# EAGLE schematic l3lfinal (EAGLE 6.5.0)
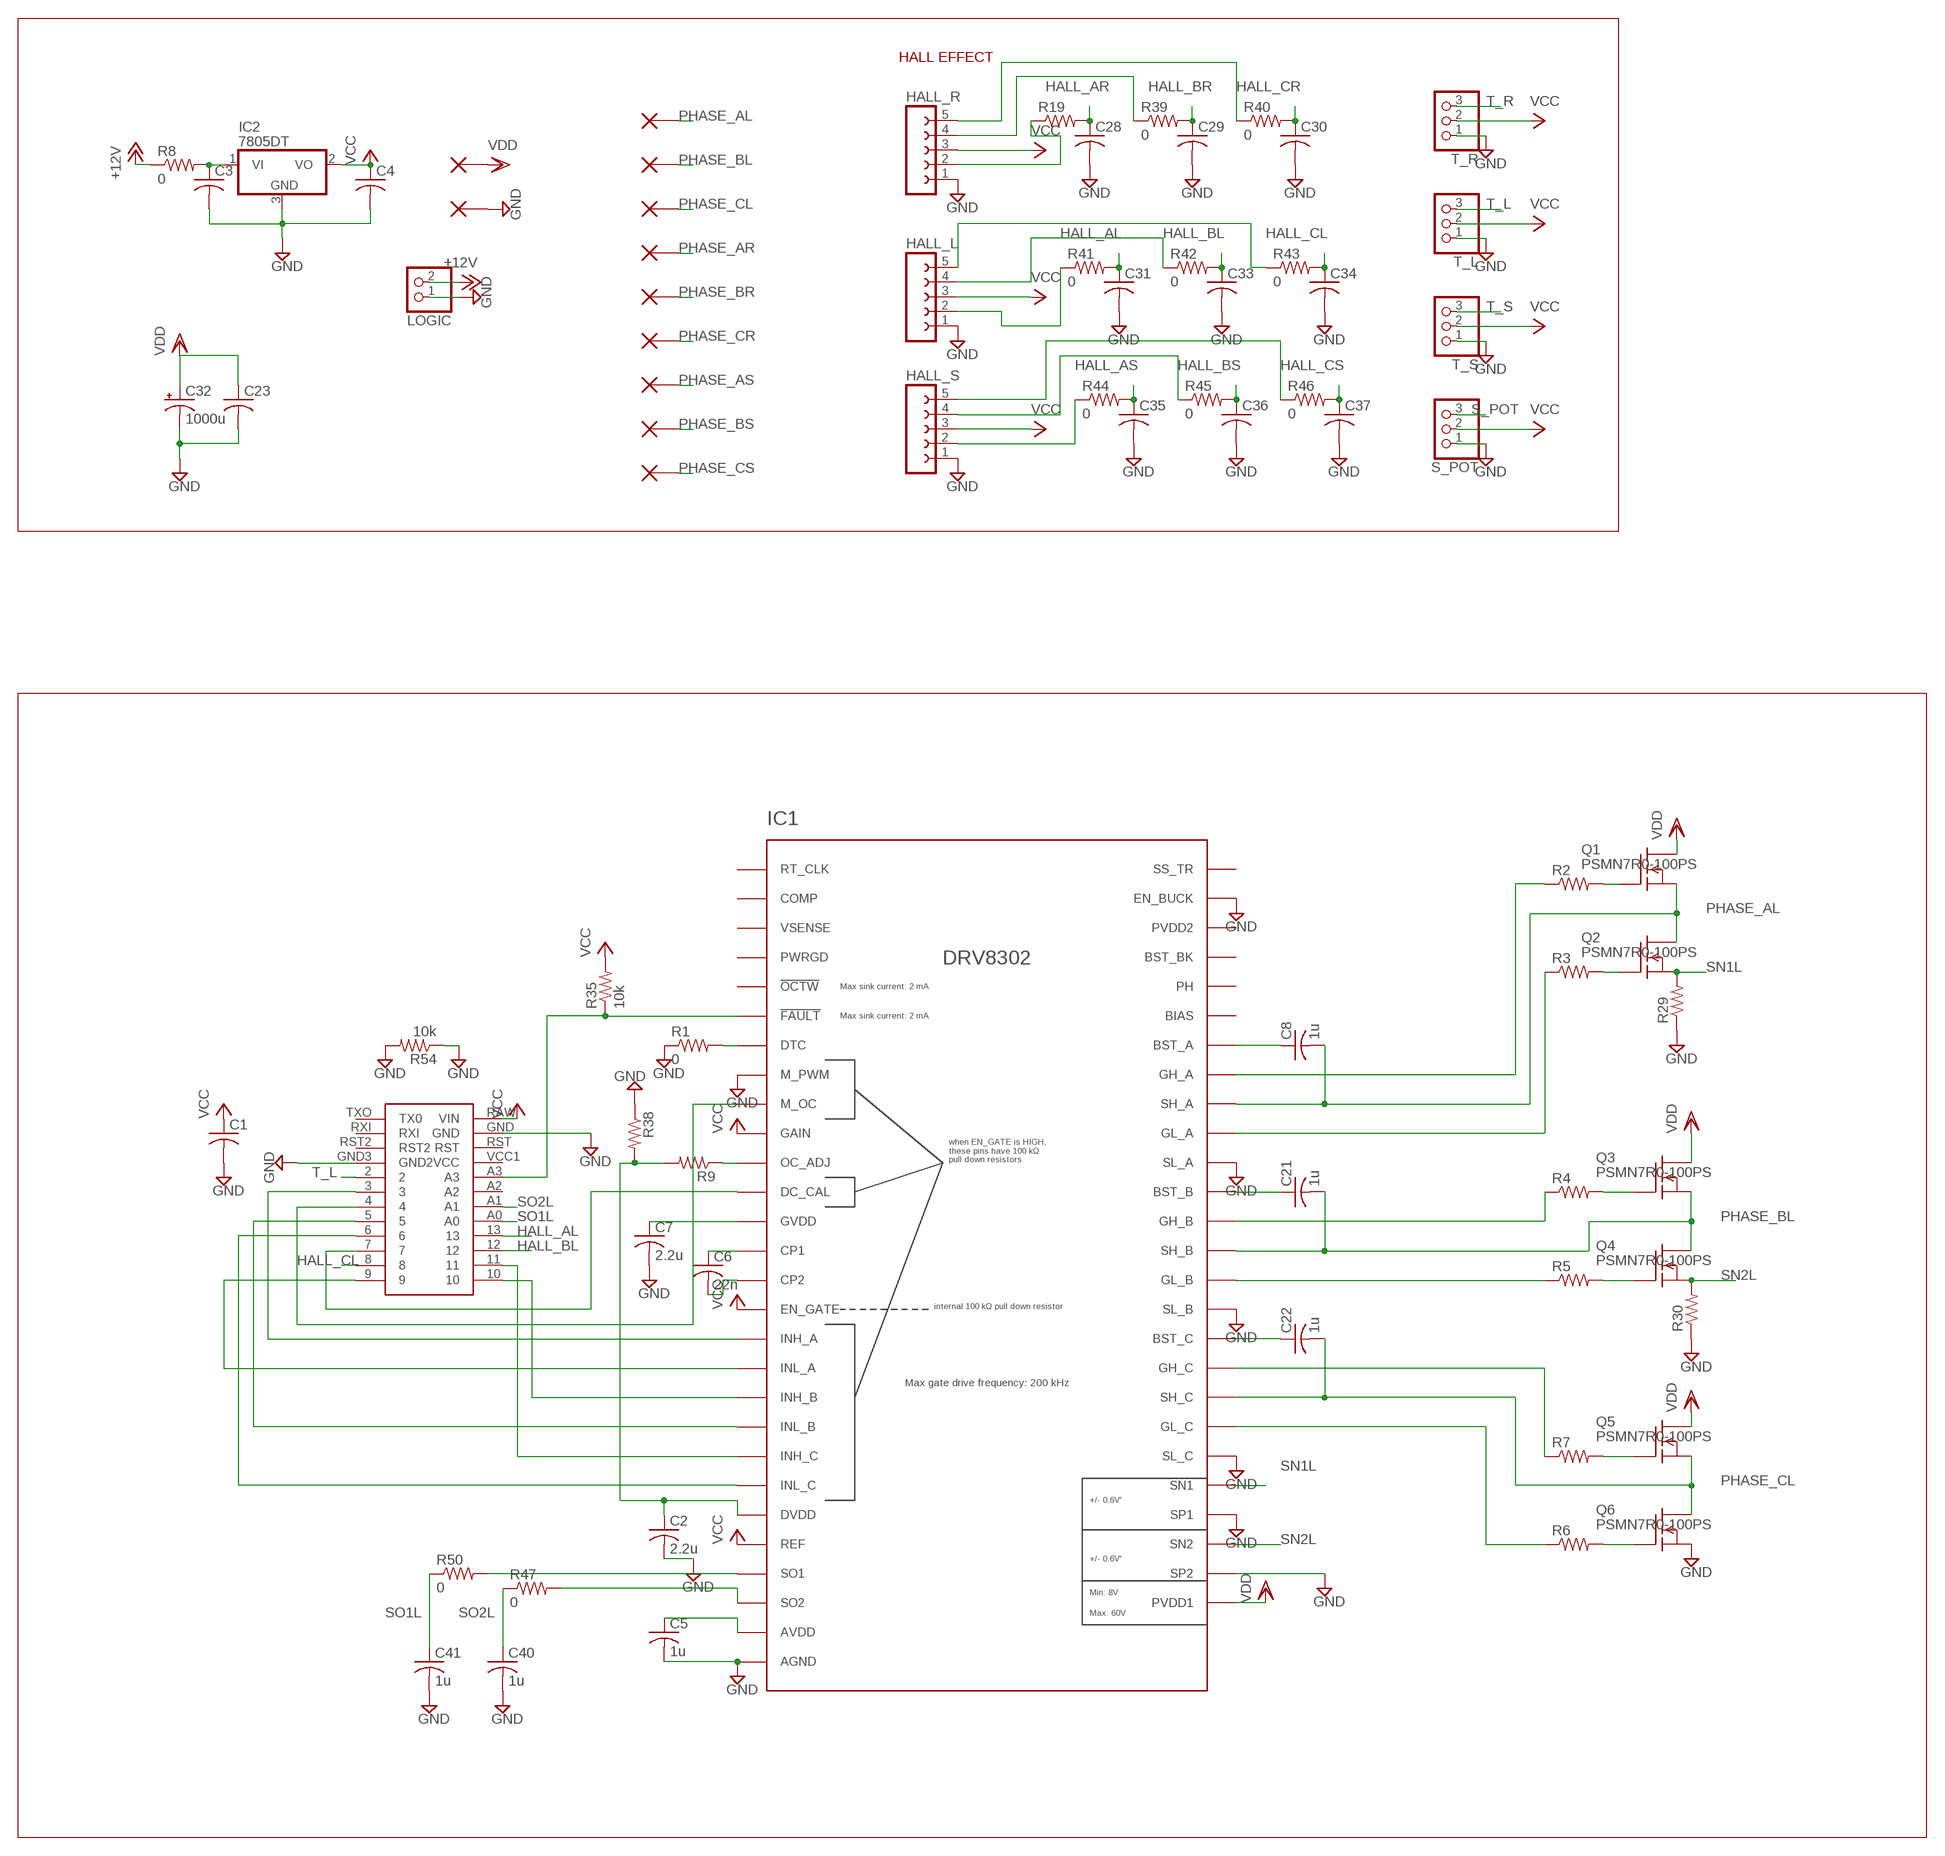
[diagram p0: schematic, sheet 1, part 1 of 3]
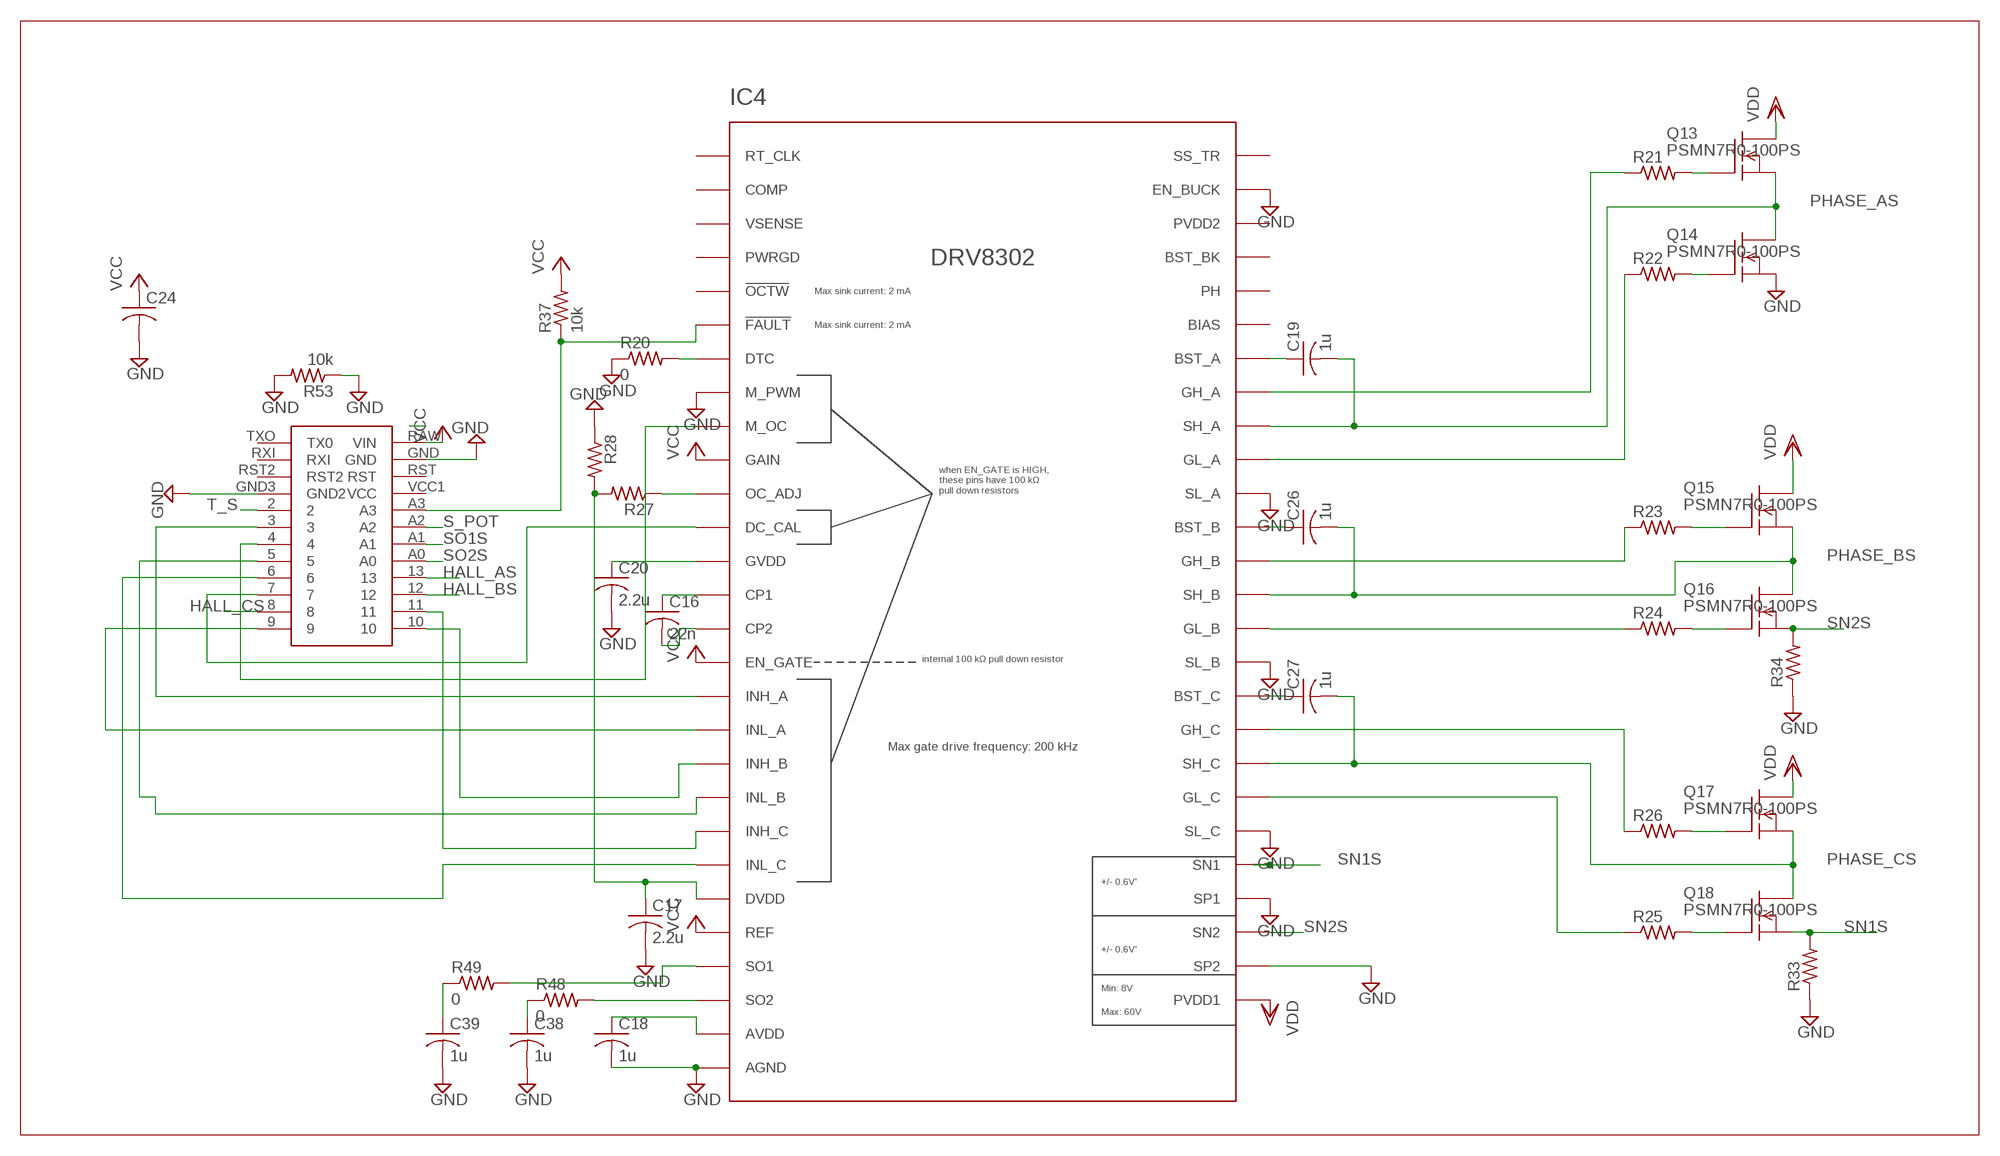
[diagram p1: schematic, sheet 1, part 2 of 3]
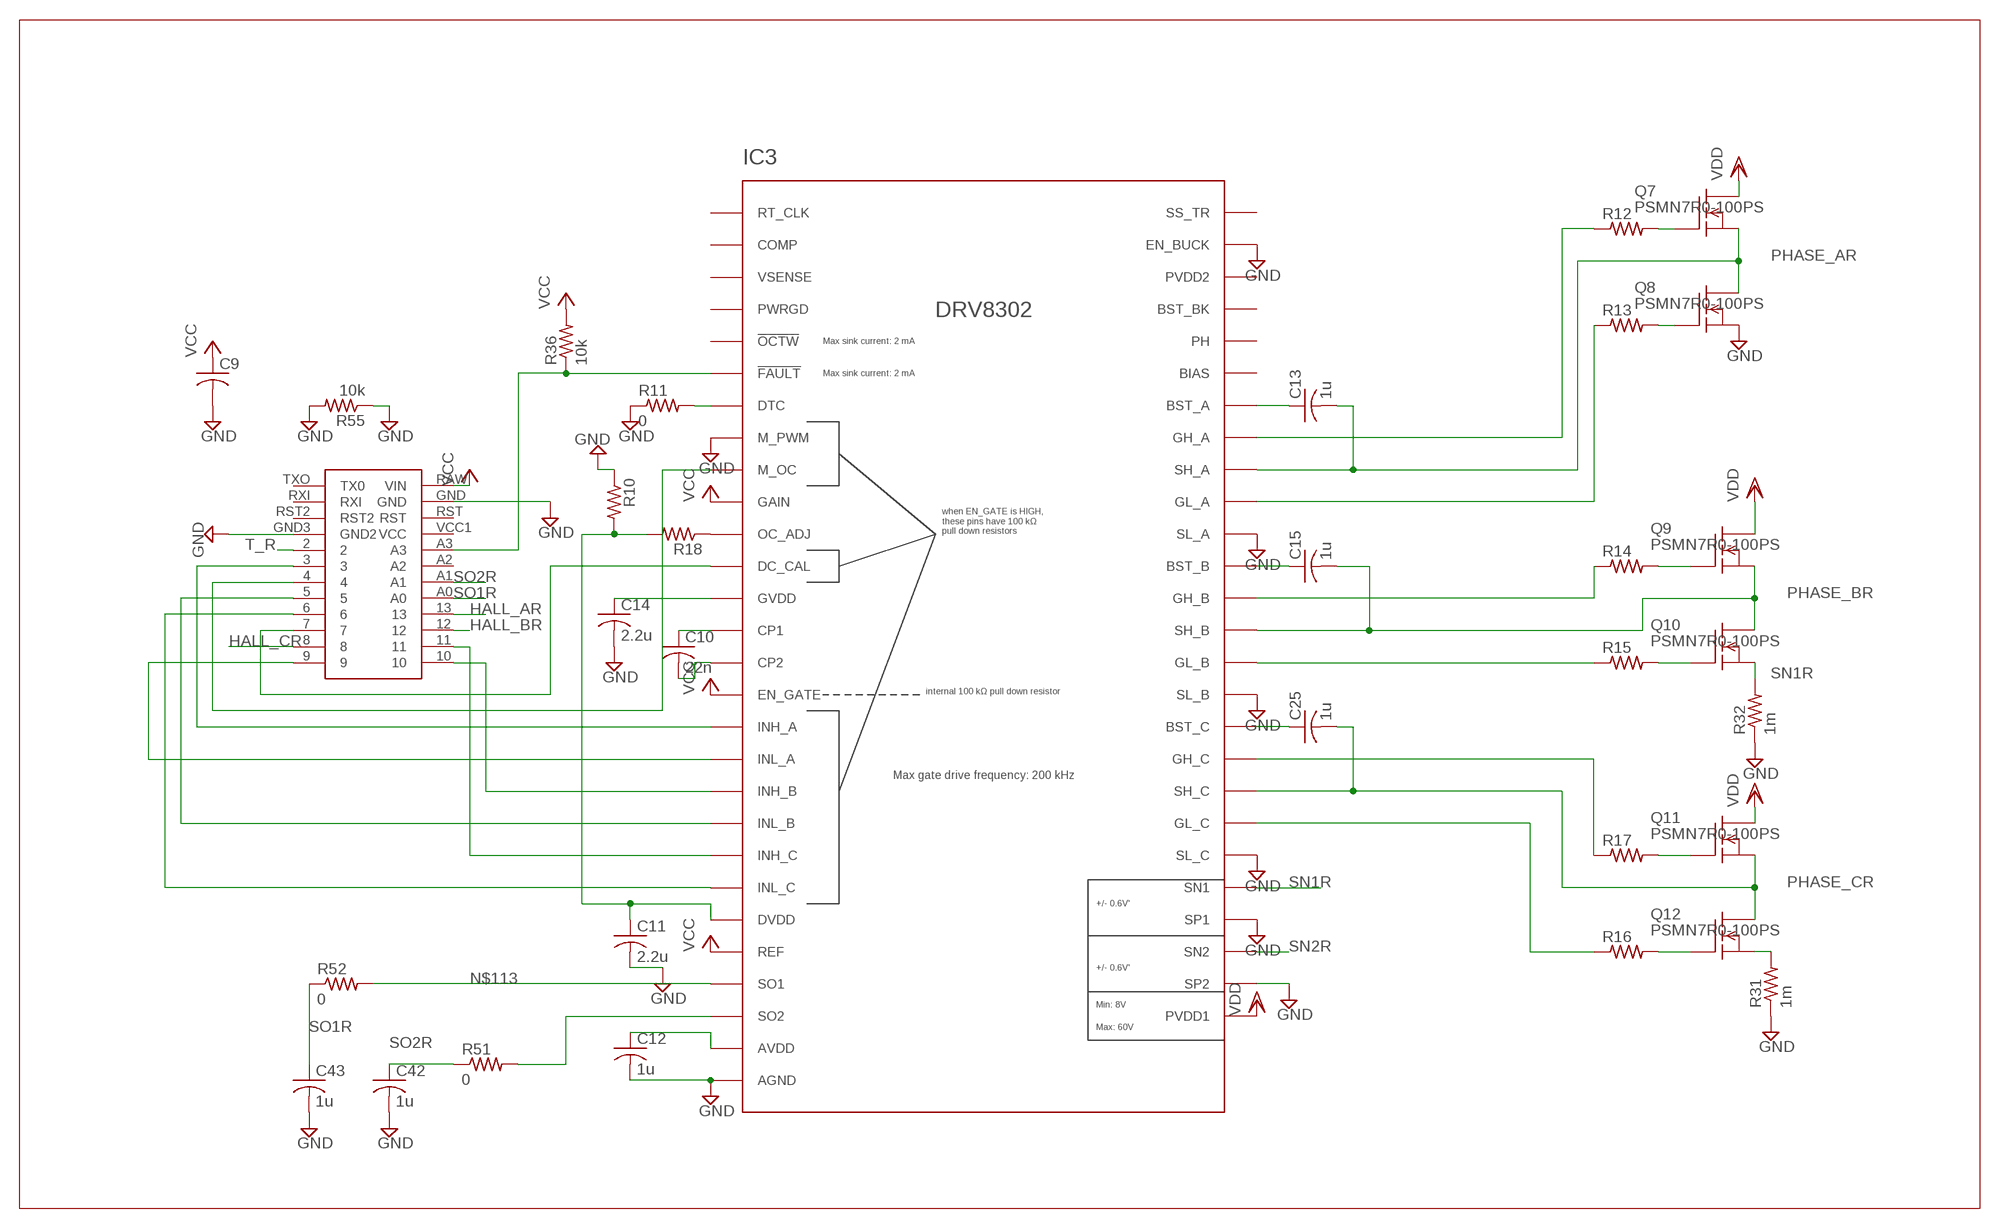
[diagram p2: schematic, sheet 1, part 3 of 3]

## Parts
C1  C-USC0805K  [C0805K]
C2  2.2u  C-USC0805K  [C0805K]
C3  C-USC1206K  [C1206K]
C4  C-USC1206K  [C1206K]
C5  1u  C-USC0805K  [C0805K]
C6  22n  C-USC0805K  [C0805K]
C7  2.2u  C-USC0805K  [C0805K]
C8  1u  C-USC0805K  [C0805K]
C9  C-USC0805K  [C0805K]
C10  22n  C-USC0805K  [C0805K]
C11  2.2u  C-USC0805K  [C0805K]
C12  1u  C-USC0805K  [C0805K]
C13  1u  C-USC0805K  [C0805K]
C14  2.2u  C-USC0805K  [C0805K]
C15  1u  C-USC0805K  [C0805K]
C16  22n  C-USC0805K  [C0805K]
C17  2.2u  C-USC0805K  [C0805K]
C18  1u  C-USC0805K  [C0805K]
C19  1u  C-USC0805K  [C0805K]
C20  2.2u  C-USC0805K  [C0805K]
C21  1u  C-USC0805K  [C0805K]
C22  1u  C-USC0805K  [C0805K]
C23  C-USC1206K  [C1206K]
C24  C-USC0805K  [C0805K]
C25  1u  C-USC0805K  [C0805K]
C26  1u  C-USC0805K  [C0805K]
C27  1u  C-USC0805K  [C0805K]
C28  C-USC0805K  [C0805K]
C29  C-USC0805K  [C0805K]
C30  C-USC0805K  [C0805K]
C31  C-USC0805K  [C0805K]
C32  1000u  CPOL-USE5-13  [E5-13]
C33  C-USC0805K  [C0805K]
C34  C-USC0805K  [C0805K]
C35  C-USC0805K  [C0805K]
C36  C-USC0805K  [C0805K]
C37  C-USC0805K  [C0805K]
C38  1u  C-USC0805K  [C0805K]
C39  1u  C-USC0805K  [C0805K]
C40  1u  C-USC0805K  [C0805K]
C41  1u  C-USC0805K  [C0805K]
C42  1u  C-USC0805K  [C0805K]
C43  1u  C-USC0805K  [C0805K]
GND  12AWG_PAD  [12AWG_PAD]
HALL_L  FE05-1  [FE05-1]
HALL_R  FE05-1  [FE05-1]
HALL_S  FE05-1  [FE05-1]
IC1  DRV8302  [TSSOP-56_3]
IC2  7805DT  [TO252]
IC3  DRV8302  [TSSOP-56_3]
IC4  DRV8302  [TSSOP-56_3]
LOGIC  PINHD-1X2  [1X02]
PHASE_AL  12AWG_PAD  [12AWG_PAD]
PHASE_AR  12AWG_PAD  [12AWG_PAD]
PHASE_AS  12AWG_PAD  [12AWG_PAD]
PHASE_BL  12AWG_PAD  [12AWG_PAD]
PHASE_BR  12AWG_PAD  [12AWG_PAD]
PHASE_BS  12AWG_PAD  [12AWG_PAD]
PHASE_CL  12AWG_PAD  [12AWG_PAD]
PHASE_CR  12AWG_PAD  [12AWG_PAD]
PHASE_CS  12AWG_PAD  [12AWG_PAD]
Q1  PSMN7R0-100PS  [TO220]
Q2  PSMN7R0-100PS  [TO220]
Q3  PSMN7R0-100PS  [TO220]
Q4  PSMN7R0-100PS  [TO220]
Q5  PSMN7R0-100PS  [TO220]
Q6  PSMN7R0-100PS  [TO220]
Q7  PSMN7R0-100PS  [TO220]
Q8  PSMN7R0-100PS  [TO220]
Q9  PSMN7R0-100PS  [TO220]
Q10  PSMN7R0-100PS  [TO220]
Q11  PSMN7R0-100PS  [TO220]
Q12  PSMN7R0-100PS  [TO220]
Q13  PSMN7R0-100PS  [TO220]
Q14  PSMN7R0-100PS  [TO220]
Q15  PSMN7R0-100PS  [TO220]
Q16  PSMN7R0-100PS  [TO220]
Q17  PSMN7R0-100PS  [TO220]
Q18  PSMN7R0-100PS  [TO220]
R1  0  R-US_R0805  [R0805]
R2  R-US_R0805  [R0805]
R3  R-US_R0805  [R0805]
R4  R-US_R0805  [R0805]
R5  R-US_R0805  [R0805]
R6  R-US_R0805  [R0805]
R7  R-US_R0805  [R0805]
R8  0  R-US_R0805  [R0805]
R9  R-US_R0805  [R0805]
R10  R-US_R0805  [R0805]
R11  0  R-US_R0805  [R0805]
R12  R-US_R0805  [R0805]
R13  R-US_R0805  [R0805]
R14  R-US_R0805  [R0805]
R15  R-US_R0805  [R0805]
R16  R-US_R0805  [R0805]
R17  R-US_R0805  [R0805]
R18  R-US_R0805  [R0805]
R19  R-US_R0805  [R0805]
R20  0  R-US_R0805  [R0805]
R21  R-US_R0805  [R0805]
R22  R-US_R0805  [R0805]
R23  R-US_R0805  [R0805]
R24  R-US_R0805  [R0805]
R25  R-US_R0805  [R0805]
R26  R-US_R0805  [R0805]
R27  R-US_R0805  [R0805]
R28  R-US_R0805  [R0805]
R29  R-US_R2512  [R2512]
R30  R-US_R2512  [R2512]
R31  1m  R-US_R2512  [R2512]
R32  1m  R-US_R2512  [R2512]
R33  R-US_R2512  [R2512]
R34  R-US_R2512  [R2512]
R35  10k  R-US_R0805  [R0805]
R36  10k  R-US_R0805  [R0805]
R37  10k  R-US_R0805  [R0805]
R38  R-US_R0805  [R0805]
R39  0  R-US_R0805  [R0805]
R40  0  R-US_R0805  [R0805]
R41  0  R-US_R0805  [R0805]
R42  0  R-US_R0805  [R0805]
R43  0  R-US_R0805  [R0805]
R44  0  R-US_R0805  [R0805]
R45  0  R-US_R0805  [R0805]
R46  0  R-US_R0805  [R0805]
R47  0  R-US_R0805  [R0805]
R48  0  R-US_R0805  [R0805]
R49  0  R-US_R0805  [R0805]
R50  0  R-US_R0805  [R0805]
R51  0  R-US_R0805  [R0805]
R52  0  R-US_R0805  [R0805]
R53  10k  R-US_R0805  [R0805]
R54  10k  R-US_R0805  [R0805]
R55  10k  R-US_R0805  [R0805]
S_POT  PINHD-1X3  [1X03]
T_L  PINHD-1X3  [1X03]
T_R  PINHD-1X3  [1X03]
T_S  PINHD-1X3  [1X03]
U$1  ARDUINOPROMINI  [ARDUINOPROMINI]
U$2  ARDUINOPROMINI  [ARDUINOPROMINI]
U$3  ARDUINOPROMINI  [ARDUINOPROMINI]
VDD  12AWG_PAD  [12AWG_PAD]

## Nets
+12V: LOGIC.2 R8.1
GND: C1.2 C2.2 C3.2 C4.2 C5.2 C7.2 C9.2 C11.2 C12.2 C14.2 C17.2 C18.2 C20.2 C23.2 C24.2 C28.2 C29.2 C30.2 C31.2 C32.- C33.2 C34.2 C35.2 C36.2 C37.2 C38.2 C39.2 C40.2 C41.2 C42.2 C43.2 GND.P$1 HALL_L.1 HALL_R.1 HALL_S.1 IC1.8(M_PWM) IC1.28(AGND) IC1.30(SP2) IC1.32(SP1) IC1.34(SL_C) IC1.39(SL_B) IC1.44(SL_A) IC1.55(EN_BUCK) IC1.57(AGND) IC1.58(AGND) IC1.59(AGND) IC2.3(GND) IC3.8(M_PWM) IC3.28(AGND) IC3.30(SP2) IC3.32(SP1) IC3.34(SL_C) IC3.39(SL_B) IC3.44(SL_A) IC3.55(EN_BUCK) IC3.57(AGND) IC3.58(AGND) IC3.59(AGND) IC4.8(M_PWM) IC4.28(AGND) IC4.30(SP2) IC4.32(SP1) IC4.34(SL_C) IC4.39(SL_B) IC4.44(SL_A) IC4.55(EN_BUCK) IC4.57(AGND) IC4.58(AGND) IC4.59(AGND) LOGIC.1 Q6.2(S) Q8.2(S) Q14.2(S) R1.1 R10.1 R11.1 R20.1 R28.1 R29.1 R30.1 R31.1 R32.1 R33.1 R34.1 R38.1 R53.1 R53.2 R54.1 R54.2 R55.1 R55.2 S_POT.1 T_L.1 T_R.1 T_S.1 U$1.GND U$1.GND3(GND2) U$2.GND U$2.GND3(GND2) U$3.GND U$3.GND3(GND2)
HALL_AL: C31.1 R41.2 U$1.13
HALL_AR: C28.1 R19.2 U$2.13
HALL_AS: C35.1 R44.2 U$3.13
HALL_BL: C33.1 R42.2 U$1.12
HALL_BR: C29.1 R39.2 U$2.12
HALL_BS: C36.1 R45.2 U$3.12
HALL_CL: C34.1 R43.2 U$1.8
HALL_CR: C30.1 R40.2 U$2.8
HALL_CS: C37.1 R46.2 U$3.8
N$1: IC1.47(GH_A) R2.1
N$2: IC1.42(GH_B) R4.1
N$3: IC1.37(GH_C) R7.1
N$4: IC1.45(GL_A) R3.1
N$5: C13.1 IC3.48(BST_A)
N$6: C3.1 IC2.1(VI) R8.2
N$7: IC1.40(GL_B) R5.1
N$8: IC1.35(GL_C) R6.1
N$9: C15.1 IC3.43(BST_B)
N$10: IC1.17(INH_A) U$1.3
N$11: IC1.18(INL_A) U$1.9
N$12: IC1.20(INL_B) U$1.5
N$13: IC1.22(INL_C) U$1.6
N$14: IC1.19(INH_B) U$1.10
N$15: IC1.21(INH_C) U$1.11
N$16: IC1.7(DTC) R1.2
N$17: Q5.1(G) R7.2
N$18: Q6.1(G) R6.2
N$19: Q4.1(G) R5.2
N$20: Q3.1(G) R4.2
N$21: Q2.1(G) R3.2
N$22: Q1.1(G) R2.2
N$23: IC3.47(GH_A) R12.1
N$24: C5.1 IC1.27(AVDD)
N$25: IC1.9(M_OC) U$1.4
N$26: C2.1 IC1.23(DVDD) R9.2 R38.2
N$27: C6.1 IC1.14(CP1)
N$28: C6.2 IC1.15(CP2)
N$29: C8.1 IC1.48(BST_A)
N$30: C7.1 IC1.13(GVDD)
N$31: IC1.11(OC_ADJ) R9.1
N$32: IC3.42(GH_B) R14.1
N$33: IC3.37(GH_C) R17.1
N$34: IC3.45(GL_A) R13.1
N$35: IC3.40(GL_B) R15.1
N$36: IC3.35(GL_C) R16.1
N$37: IC3.17(INH_A) U$2.3
N$38: IC3.18(INL_A) U$2.9
N$39: IC3.20(INL_B) U$2.5
N$40: IC3.22(INL_C) U$2.6
N$41: IC4.20(INL_B) U$3.5
N$42: IC3.21(INH_C) U$2.11
N$43: IC3.7(DTC) R11.2
N$44: Q11.1(G) R17.2
N$45: Q12.1(G) R16.2
N$46: Q10.1(G) R15.2
N$47: Q9.1(G) R14.2
N$48: Q8.1(G) R13.2
N$49: Q7.1(G) R12.2
N$50: C12.1 IC3.27(AVDD)
N$51: IC3.9(M_OC) U$2.4
N$52: C11.1 IC3.23(DVDD) R10.2 R18.2
N$53: C10.1 IC3.14(CP1)
N$54: C10.2 IC3.15(CP2)
N$55: C25.1 IC3.38(BST_C)
N$56: C14.1 IC3.13(GVDD)
N$57: IC3.11(OC_ADJ) R18.1
N$58: C19.1 IC4.48(BST_A)
N$59: IC4.47(GH_A) R21.1
N$60: IC4.42(GH_B) R23.1
N$61: IC4.37(GH_C) R26.1
N$62: IC4.45(GL_A) R22.1
N$63: IC4.40(GL_B) R24.1
N$64: IC4.35(GL_C) R25.1
N$65: IC4.17(INH_A) U$3.3
N$66: IC4.18(INL_A) U$3.9
N$67: HALL_L.2 R41.1
N$68: IC4.22(INL_C) U$3.6
N$69: IC4.19(INH_B) U$3.10
N$70: IC4.21(INH_C) U$3.11
N$71: IC4.7(DTC) R20.2
N$72: Q17.1(G) R26.2
N$73: Q18.1(G) R25.2
N$74: Q16.1(G) R24.2
N$75: Q15.1(G) R23.2
N$76: Q14.1(G) R22.2
N$77: Q13.1(G) R21.2
N$78: C18.1 IC4.27(AVDD)
N$79: IC4.9(M_OC) U$3.4
N$80: C17.1 IC4.23(DVDD) R27.2 R28.2
N$81: C16.1 IC4.14(CP1)
N$82: C16.2 IC4.15(CP2)
N$83: C26.1 IC4.43(BST_B)
N$84: C20.1 IC4.13(GVDD)
N$85: IC4.11(OC_ADJ) R27.1
N$86: C27.1 IC4.38(BST_C)
N$87: IC3.12(DC_CAL) U$2.7
N$88: C21.1 IC1.43(BST_B)
N$89: C22.1 IC1.38(BST_C)
N$90: IC1.12(DC_CAL) U$1.7
N$92: IC1.6(!FAULT!) R35.1 U$1.A3
N$93: IC4.6(!FAULT!) R37.1 U$3.A3
N$94: IC3.6(!FAULT!) R36.1 U$2.A3
N$95: IC3.19(INH_B) U$2.10
N$96: HALL_L.4 R42.1
N$97: HALL_L.5 R43.1
N$98: HALL_R.2 R19.1
N$99: HALL_R.4 R39.1
N$100: HALL_R.5 R40.1
N$101: HALL_S.2 R44.1
N$102: HALL_S.4 R45.1
N$103: HALL_S.5 R46.1
N$105: IC4.12(DC_CAL) U$3.7
N$106: IC4.26(SO2) R48.2
N$107: IC4.25(SO1) R49.2
N$110: IC1.26(SO2) R47.2
N$111: IC1.25(SO1) R50.2
N$112: IC3.26(SO2) R51.2
N$113: IC3.25(SO1) R52.2
PHASE_AL: C8.2 IC1.46(SH_A) PHASE_AL.P$1 Q1.2(S) Q2.3(D)
PHASE_AR: C13.2 IC3.46(SH_A) PHASE_AR.P$1 Q7.2(S) Q8.3(D)
PHASE_AS: C19.2 IC4.46(SH_A) PHASE_AS.P$1 Q13.2(S) Q14.3(D)
PHASE_BL: C21.2 IC1.41(SH_B) PHASE_BL.P$1 Q3.2(S) Q4.3(D)
PHASE_BR: C15.2 IC3.41(SH_B) PHASE_BR.P$1 Q9.2(S) Q10.3(D)
PHASE_BS: C26.2 IC4.41(SH_B) PHASE_BS.P$1 Q15.2(S) Q16.3(D)
PHASE_CL: C22.2 IC1.36(SH_C) PHASE_CL.P$1 Q5.2(S) Q6.3(D)
PHASE_CR: C25.2 IC3.36(SH_C) PHASE_CR.P$1 Q11.2(S) Q12.3(D)
PHASE_CS: C27.2 IC4.36(SH_C) PHASE_CS.P$1 Q17.2(S) Q18.3(D)
S_POT: S_POT.3 U$3.A2
SN1L: IC1.33(SN1) Q2.2(S) R29.2
SN1R: IC3.33(SN1) Q10.2(S) R32.2
SN1S: IC4.33(SN1) Q18.2(S) R33.2
SN2L: IC1.31(SN2) Q4.2(S) R30.2
SN2R: IC3.31(SN2) Q12.2(S) R31.2
SN2S: IC4.31(SN2) Q16.2(S) R34.2
SO1L: C41.1 R50.1 U$1.A0
SO1R: C43.1 R52.1 U$2.A0
SO1S: C39.1 R49.1 U$3.A1
SO2L: C40.1 R47.1 U$1.A1
SO2R: C42.1 R51.1 U$2.A1
SO2S: C38.1 R48.1 U$3.A0
T_L: T_L.3 U$1.2
T_R: T_R.3 U$2.2
T_S: T_S.3 U$3.2
VCC: C1.1 C4.1 C9.1 C24.1 HALL_L.3 HALL_R.3 HALL_S.3 IC1.10(GAIN) IC1.16(EN_GATE) IC1.24(REF) IC2.2(VO) IC3.10(GAIN) IC3.16(EN_GATE) IC3.24(REF) IC4.10(GAIN) IC4.16(EN_GATE) IC4.24(REF) R35.2 R36.2 R37.2 S_POT.2 T_L.2 T_R.2 T_S.2 U$1.RAW(VIN) U$2.RAW(VIN) U$3.RAW(VIN)
VDD: C23.1 C32.+ IC1.29(PVDD1) IC3.29(PVDD1) IC4.29(PVDD1) Q1.3(D) Q3.3(D) Q5.3(D) Q7.3(D) Q9.3(D) Q11.3(D) Q13.3(D) Q15.3(D) Q17.3(D) VDD.P$1
Unconnected: IC1.1(RT_CLK) IC1.2(COMP) IC1.3(VSENSE) IC1.4(PWRGD) IC1.5(!OCTW!) IC1.49(BIAS) IC1.50(PH) IC1.51(PH) IC1.53(PVDD2) IC1.54(PVDD2) IC1.56(SS_TR) IC3.1(RT_CLK) IC3.2(COMP) IC3.3(VSENSE) IC3.4(PWRGD) IC3.5(!OCTW!) IC3.49(BIAS) IC3.50(PH) IC3.51(PH) IC3.53(PVDD2) IC3.54(PVDD2) IC3.56(SS_TR) IC4.1(RT_CLK) IC4.2(COMP) IC4.3(VSENSE) IC4.4(PWRGD) IC4.5(!OCTW!) IC4.49(BIAS) IC4.50(PH) IC4.51(PH) IC4.53(PVDD2) IC4.54(PVDD2) IC4.56(SS_TR) U$1.A2 U$1.RST U$1.RST2 U$1.RXI U$1.TXO(TX0) U$1.VCC1(VCC) U$2.A2 U$2.RST U$2.RST2 U$2.RXI U$2.TXO(TX0) U$2.VCC1(VCC) U$3.RST U$3.RST2 U$3.RXI U$3.TXO(TX0) U$3.VCC1(VCC)

## Notes on the sheet
- HALL EFFECT

## Power pins joined to a net without a drawn wire
BST_BK: IC1.52(BST_BK) IC3.52(BST_BK) IC4.52(BST_BK)

## Library data of the parts
C1-C31 C33-C43 = rcl:C-US: CAPACITOR, American symbol
C32 = rcl:CPOL-US: POLARIZED CAPACITOR, American symbol
GND PHASE_AL PHASE_AR PHASE_AS PHASE_BL PHASE_BR PHASE_BS PHASE_CL PHASE_CR PHASE_CS VDD = tutorial:12AWG_PAD
HALL_L HALL_R HALL_S = con-lsta:FE05-1: FEMALE HEADER; OC_FARNELL: unknown; OC_NEWARK: unknown
IC1 IC3 IC4 = RoboJackets-PowerICs:DRV8302
IC2 = linear:78*: Positive VOLTAGE REGULATOR Source: http://cache.national.com/ds/LM/LM78L05.pdf http://www.fairchildsemi.com/ds/LM/LM7805.pdf
LOGIC = pinhead:PINHD-1X2: PIN HEADER
Q1-Q18 = l3l_final:PSMN7R0-100PS: N-Channel TO220 MOSFET 100V 6.8mOhm MOSFET
R1 R8-R11 R18-R20 R27 R28 R35-R55 = resistor:R-US_: RESISTOR, American symbol
R2-R7 R12-R17 R21-R26 R29-R34 = rcl:R-US_: RESISTOR, American symbol
S_POT T_L T_R T_S = pinhead:PINHD-1X3: PIN HEADER
U$1-U$3 = l3l_final:ARDUINOPROMINI: Arduino Pro Mini with dip package